# Altium schematic sheet OLED.schdoc
size 155 x 73 mm
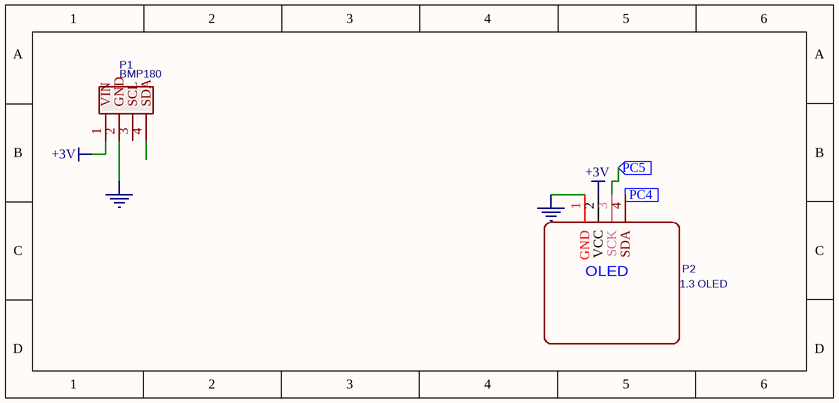
[diagram p0: OLED.schdoc]

## Parts
P1  BMP180  [HDR-4X1/2.54]
P2  1.3 OLED  [OLED 1.3 IIC/I2C]

## Ports
PC4 (in), PC5 (in)

## Nets
+3V: P1.1(VIN) P2.2(VCC)
GND: P1.2(GND) P2.1(GND)
PC4: P2.4(SDA) ; port PC4
PC5: P2.3(SCK) ; port PC5

Not connected (* = marked no-connect by the designer): P1 3(SCL) 4(SDA)

## Notes on the sheet
- (in symbol 1.3 OLED) OLED

## Library data of the parts
P1 = BMP180: BOM_Manufacturer: ReliaPro; BOM_Manufacturer Part: Headers  Pins 1*4P; BOM_Supplier: LCSC; spicePre: P; BOM_Supplier Part: C59481
P2 = 1.3 OLED: catid: 20; sourceId: 1T5FDZYC8; timeStamp: 1460015424; BOM_Supplier: Aliexpress; BOM_Manufacturer Part: ?; spicePre: P